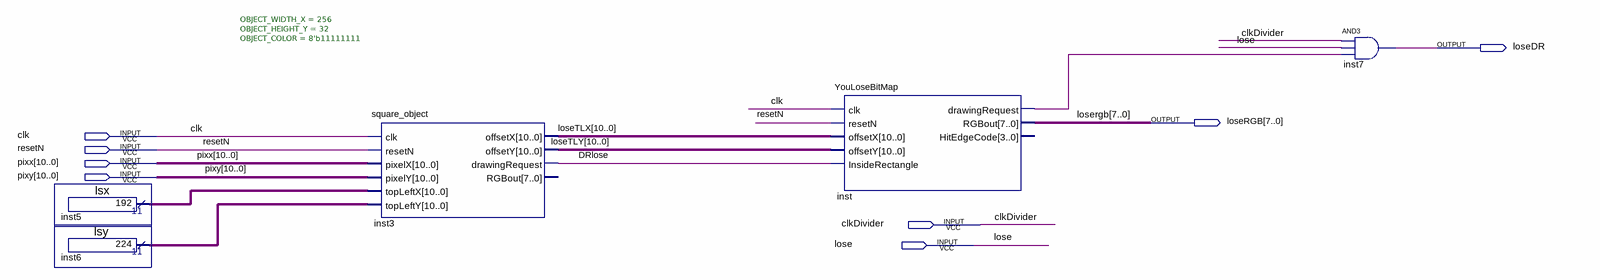
[diagram p0: schematic sheet]
// Quartus schematic loseDisplay.bdf as structural Verilog: 5 symbols, 8 pins
module loseDisplay (
  input  clk,
  input  resetN,
  input  [10:0] pixx,
  input  [10:0] pixy,
  input  clkDivider,
  input  lose,
  output loseDR,
  output [7:0] loseRGB
);

  wire DRlose, inst_drawingrequest;
  wire [10:0] inst5_result, inst6_result, loseTLX, loseTLY;

  lsx inst5 (.result(inst5_result));
  lsy inst6 (.result(inst6_result));
  square_object #(.OBJECT_WIDTH_X(256), .OBJECT_HEIGHT_Y(32), .OBJECT_COLOR(8'b11111111)) inst3 (
    .clk(clk), .resetN(resetN), .pixelX(pixx), .pixelY(pixy), .topLeftX(inst5_result),
    .topLeftY(inst6_result), .offsetX(loseTLX), .offsetY(loseTLY), .drawingRequest(DRlose));  // open: RGBout
  YouLoseBitMap inst (
    .clk(clk), .resetN(resetN), .offsetX(loseTLX), .offsetY(loseTLY), .InsideRectangle(DRlose),
    .drawingRequest(inst_drawingrequest), .RGBout(loseRGB));  // open: HitEdgeCode
  and inst7 (loseDR, clkDivider, lose, inst_drawingrequest);
endmodule
